# EAGLE design Sensor_MT9P (EAGLE 9.2.1)
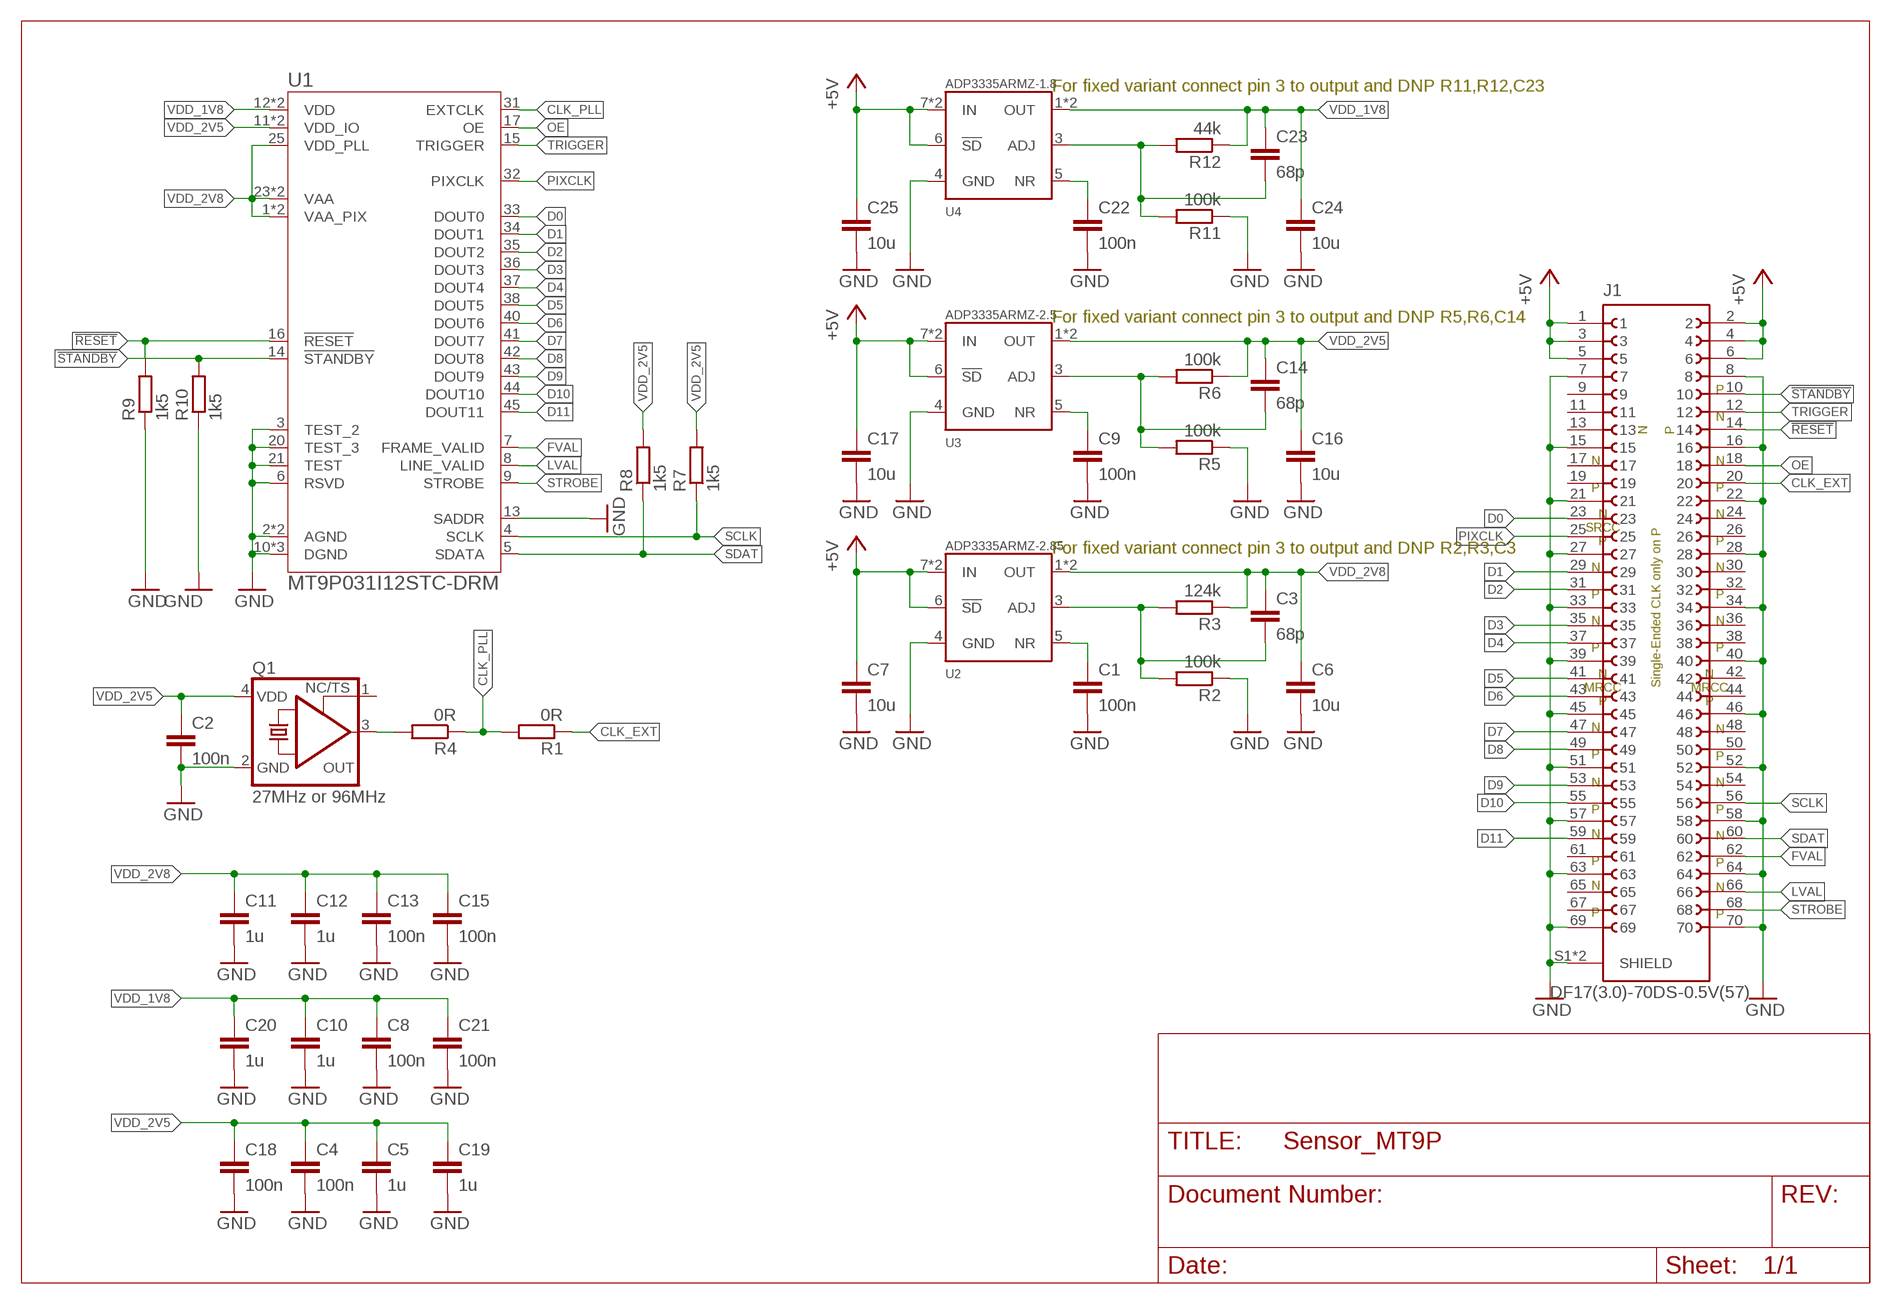
[diagram p0: schematic, sheet 1]

## Parts
C1  100n  C-EUC0402  [C0402]
C2  100n  C-EUC0402  [C0402]
C3  68p  C-EUC0402  [C0402]
C4  100n  C-EUC0402  [C0402]
C5  1u  C-EUC0402  [C0402]
C6  10u  C-EUC0603  [C0603]
C7  10u  C-EUC0603  [C0603]
C8  100n  C-EUC0402  [C0402]
C9  100n  C-EUC0402  [C0402]
C10  1u  C-EUC0402  [C0402]
C11  1u  C-EUC0402  [C0402]
C12  1u  C-EUC0402  [C0402]
C13  100n  C-EUC0402  [C0402]
C14  68p  C-EUC0402  [C0402]
C15  100n  C-EUC0402  [C0402]
C16  10u  C-EUC0603  [C0603]
C17  10u  C-EUC0603  [C0603]
C18  100n  C-EUC0402  [C0402]
C19  1u  C-EUC0402  [C0402]
C20  1u  C-EUC0402  [C0402]
C21  100n  C-EUC0402  [C0402]
C22  100n  C-EUC0402  [C0402]
C23  68p  C-EUC0402  [C0402]
C24  10u  C-EUC0603  [C0603]
C25  10u  C-EUC0603  [C0603]
J1  DF17(3.0)-70DS-0.5V(57)  [DF17(3.0)-70DS-0.5V(57)]
Q1  27MHz or 96MHz  KXO-PXO/XO-V96  [3.2X2.5_KXO-V96]
R1  0R  R-EU_R0402  [R0402]
R2  100k  R-EU_R0402  [R0402]
R3  124k  R-EU_R0402  [R0402]
R4  0R  R-EU_R0402  [R0402]
R5  100k  R-EU_R0402  [R0402]
R6  100k  R-EU_R0402  [R0402]
R7  1k5  R-EU_R0402  [R0402]
R8  1k5  R-EU_R0402  [R0402]
R9  1k5  R-EU_R0402  [R0402]
R10  1k5  R-EU_R0402  [R0402]
R11  100k  R-EU_R0402  [R0402]
R12  44k  R-EU_R0402  [R0402]
U1  MT9P031I12STC-DRM  [ILCC48_10X10_847AA-O_OSI-M]
U2  ADP3335ARMZ-2.85  NCP3335  [MSOP08]
U3  ADP3335ARMZ-2.5  NCP3335  [MSOP08]
U4  ADP3335ARMZ-1.8  NCP3335  [MSOP08]

## Nets
!RESET: J1.14 R9.2 U1.16(!RESET)
!STANDBY: J1.10 R10.2 U1.14(!STANDBY)
+5V: C7.1 C17.1 C25.1 J1.1 J1.2 J1.3 J1.4 J1.5 J1.6 U2.6(!SD) U2.7(IN) U2.8(IN) U3.6(!SD) U3.7(IN) U3.8(IN) U4.6(!SD) U4.7(IN) U4.8(IN)
CLK: Q1.3(OUT) R4.2
CLK_EXT: J1.20 R1.1
CLK_PLL: R1.2 R4.1 U1.31(EXTCLK)
D0: J1.23 U1.33(DOUT0)
D1: J1.29 U1.34(DOUT1)
D2: J1.31 U1.35(DOUT2)
D3: J1.35 U1.36(DOUT3)
D4: J1.37 U1.37(DOUT4)
D5: J1.41 U1.38(DOUT5)
D6: J1.43 U1.40(DOUT6)
D7: J1.47 U1.41(DOUT7)
D8: J1.49 U1.42(DOUT8)
D9: J1.53 U1.43(DOUT9)
D10: J1.55 U1.44(DOUT10)
D11: J1.59 U1.45(DOUT11)
FVAL: J1.62 U1.7(FRAME_VALID)
GND: C1.2 C2.2 C4.2 C5.2 C6.2 C7.2 C8.2 C9.2 C10.2 C11.2 C12.2 C13.2 C15.2 C16.2 C17.2 C18.2 C19.2 C20.2 C21.2 C22.2 C24.2 C25.2 J1.7 J1.8 J1.15 J1.16 J1.21 J1.22 J1.27 J1.28 J1.33 J1.34 J1.39 J1.40 J1.45 J1.46 J1.51 J1.52 J1.57 J1.58 J1.63 J1.64 J1.69 J1.70 J1.S1(SHIELD) J1.S2(SHIELD) Q1.2(GND) R2.1 R5.1 R9.1 R10.1 R11.1 U1.2(AGND) U1.3(TEST_2) U1.6(RSVD) U1.10(DGND) U1.13(SADDR) U1.20(TEST_3) U1.21(TEST) U1.22(AGND) U1.26(DGND) U1.46(DGND) U2.4(GND) U3.4(GND) U4.4(GND)
LVAL: J1.66 U1.8(LINE_VALID)
N$00002: C1.1 U2.5(NR)
N$00003: C22.1 U4.5(NR)
N$00004: C9.1 U3.5(NR)
N$00005: C23.2 R11.2 R12.2 U4.3(ADJ)
N$00006: C14.2 R5.2 R6.2 U3.3(ADJ)
N$00010: C3.2 R2.2 R3.2 U2.3(ADJ)
OE: J1.18 U1.17(OE)
PIXCLK: J1.25 U1.32(PIXCLK)
SCLK: J1.56 R7.1 U1.4(SCLK)
SDAT: J1.60 R8.1 U1.5(SDATA)
STROBE: J1.68 U1.9(STROBE)
TRIGGER: J1.12 U1.15(TRIGGER)
VDD_1V8: C8.1 C10.1 C20.1 C21.1 C23.1 C24.1 R12.1 U1.12(VDD) U1.47(VDD) U4.1(OUT) U4.2(OUT)
VDD_2V5: C2.1 C4.1 C5.1 C14.1 C16.1 C18.1 C19.1 Q1.4(VDD) R6.1 R7.2 R8.2 U1.11(VDD_IO) U1.39(VDD_IO) U3.1(OUT) U3.2(OUT)
VDD_2V8: C3.1 C6.1 C11.1 C12.1 C13.1 C15.1 R3.1 U1.1(VAA_PIX) U1.23(VAA) U1.24(VAA) U1.25(VDD_PLL) U1.48(VAA_PIX) U2.1(OUT) U2.2(OUT)
Unconnected: J1.9 J1.11 J1.13 J1.17 J1.19 J1.24 J1.26 J1.30 J1.32 J1.36 J1.38 J1.42 J1.44 J1.48 J1.50 J1.54 J1.61 J1.65 J1.67 Q1.1(TS)

## Notes on the sheet
- For fixed variant connect pin 3 to output and DNP R11,R12,C23
- For fixed variant connect pin 3 to output and DNP R5,R6,C14
- P
   
  N
- N
   
  P
- N
   
  P
- N
   
  P
- N
  SRCC
  P
- N
   
  P
- For fixed variant connect pin 3 to output and DNP R2,R3,C3
- N
   
  P
- N
   
  P
- Single-Ended CLK only on P
- N
   
  P
- N
   
  P
- N
  MRCC
  P
- N
  MRCC
  P
- N
   
  P
- N
   
  P
- N
   
  P
- N
   
  P
- N
   
  P
- N
   
  P
- N
   
  P
- N
   
  P

## Library data of the parts
C1 C3 C4 C8 C9 C13-C15 C18 C21-C23 = rcl:C-EU: CAPACITOR, European symbol; LCSC: C1525; SPICEPREFIX: C
C2 = rcl:C-EU: CAPACITOR, European symbol; LCSC: C1525
C5-C7 C10-C12 C16 C17 C19 C20 C24 C25 = rcl:C-EU: CAPACITOR, European symbol; SPICEPREFIX: C
J1 = Hirose:DF17(3.0)-70DS-0.5V(57)
Q1 = crystal-geyer_V1_0:KXO-PXO/XO-V: Clock Oscillator (PXO/XO) MHz : KXO-V - Serie Model Size l/w/h [mm] Frequency Range Frequency Stability Temp. Range [°C] Output AECQ 200 availabel Datasheet KXO-V94 KXO-V94 KXO-V95 KXO-V95 KXO-V96 KXO-V96 KXO-V99 KXO-V99 KXO-97 KXO-V97 KXO-97 - KXO-V97 2.0/1.6/0.80 2.0/1.6/0.80 2.5/2.0/0.82 2.5/2.0/0.82 3.2/2.5/1.2 3.2/2.5/1.2 5.0/3.2/1.2 5.0/3.2/1.2 7.0/5.08/1.3 7.0/5.08/1.3 7.0/5.08/1.3 32,768 kHz 1,0 ~ 80,0 MHz 32,768 kHz 1,0 ~ 70,0 MHz 32,768 kHz 1,0 ~ 156,0 MHz 32,768 kHz 1,0 ~ 200,0 MHz 32,768 kHz 32,768 kHz 1,0 ~ 160,0 MHz ±25 … ±100ppm ±25 … ±100ppm ±25 … ±100ppm ±25 … ±100ppm ±25 … ±100ppm ±25 … ±100ppm ±25 … ±100ppm ±25 … ±100ppm ±25 … ±100ppm ±25 … ±100ppm ±25 … ±100ppm (*) -40°C …+85°C (*) -40°C …+85°C (*) -40°C …+85°C (*) -40°C …+85°C (*) -40°C …+85°C (*) -40°C …+85°C (*) -40°C …+85°C (*) -40°C …+85°C (*) -40°C …+85°C (*) -40°C …+85°C (*) -40°C …+85°C HCMOS HCMOS HCMOS HCMOS HCMOS HCMOS HCMOS HCMOS HCMOS HCMOS HCMOS - - yes yes yes yes - - - - - KXO-V94-kHz.pdf <http://www.geyer-electronic.de/uploads/tx_userartikelfrequenz/GEYER-KXO-V94-kHz.pdf> KXO-V94.pdf <http://www.geyer-electronic.de/uploads/tx_userartikelfrequenz/GEYER-KXO-V94.pdf> KXO-V95-kHz.pdf <http://www.geyer-electronic.de/uploads/tx_userartikelfrequenz/GEYER-KXO-V95-kHz.pdf> KXO-V95.pdf <http://www.geyer-electronic.de/uploads/tx_userartikelfrequenz/GEYER-KXO-V95.pdf> KXO-V96-kHz.pdf <http://www.geyer-electronic.de/uploads/tx_userartikelfrequenz/GEYER-KXO-V96-kHz.pdf> KXO-V96.pdf <http://www.geyer-electronic.de/uploads/tx_userartikelfrequenz/GEYER-KXO-V96.pdf> KXO-V99-kHz.pdf <http://www.geyer-electronic.de/uploads/tx_userartikelfrequenz/GEYER-KXO-V99-kHz.pdf> KXO-V99.pdf <http://www.geyer-electronic.de/uploads/tx_userartikelfrequenz/GEYER-KXO-V99.pdf> KXO-97-kHz.pdf <http://www.geyer-electronic.de/uploads/tx_userartikelfrequenz/GEYER-KXO-97-kHz.pdf> KXO-V97-kHz.pdf <http://www.geyer-electronic.de/uploads/tx_userartikelfrequenz/GEYER-KXO-V97-kHz.pdf> KXO-V97.pdf <http://www.geyer-electronic.de/uploads/tx_userartikelfrequenz/GEYER-KXO-V97.pdf> <http://www.geyer-electronic.de/fileadmin/template/img/logo-geyer-electronic.png> Details see: http://www.geyer-electronic.de/Frequenz-Produkte.9.0.html Created 2016-06-07, Hans Locher 2016 (C) Geyer Quartz Technology Hans Locher KXOV94,KXOV95;KXOV96;KXOV97;KXO97;2016;2520;3225;5032;70508;2,5x2,0;3,2x2,5;5,0x3,2;7,0x5,08;2.5x2.0;3.2x2.5;5.0x3.2;7.0x5.08;
R1-R12 = rcl:R-EU_: RESISTOR, European symbol; SPICEPREFIX: R
U1 = onsemi:MT9P031I12STC-DR; DIGIKEY: MT9P031I12STC-DR-ND; MANUFACTURER_NAME: onsemi; MPN: MT9P031I12STC-DR
U2 = analog_devices:NCP3335: NCP3335 Low Dropout Regulator - Ultra High Accuracy, Low Iq, 500 mA; DIGIKEY: 505-ADP3335ARMZ-3.3RL7CT-ND
U3 = analog_devices:NCP3335: NCP3335 Low Dropout Regulator - Ultra High Accuracy, Low Iq, 500 mA; DIGIKEY: 505-ADP3335ARMZ-2.5-RLCT-ND
U4 = analog_devices:NCP3335: NCP3335 Low Dropout Regulator - Ultra High Accuracy, Low Iq, 500 mA; DIGIKEY: 505-ADP3335ARMZ-1.8-R7CT-ND

## Board
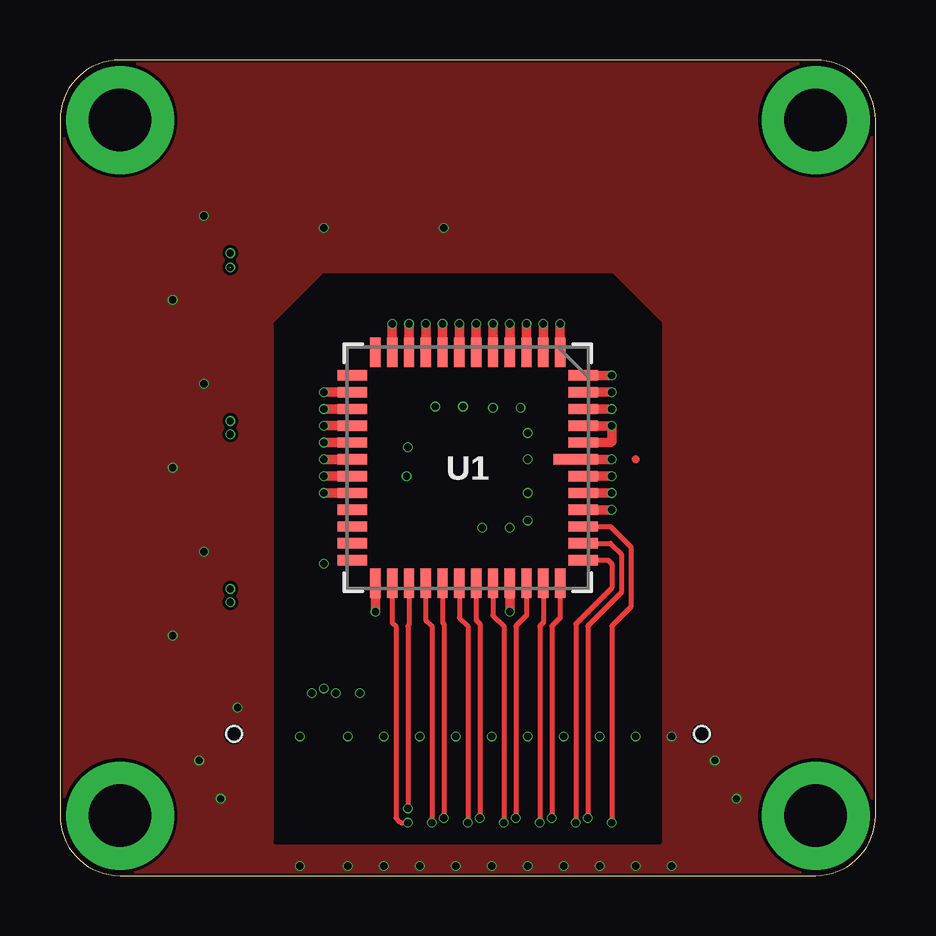
[diagram p1: board, top side]
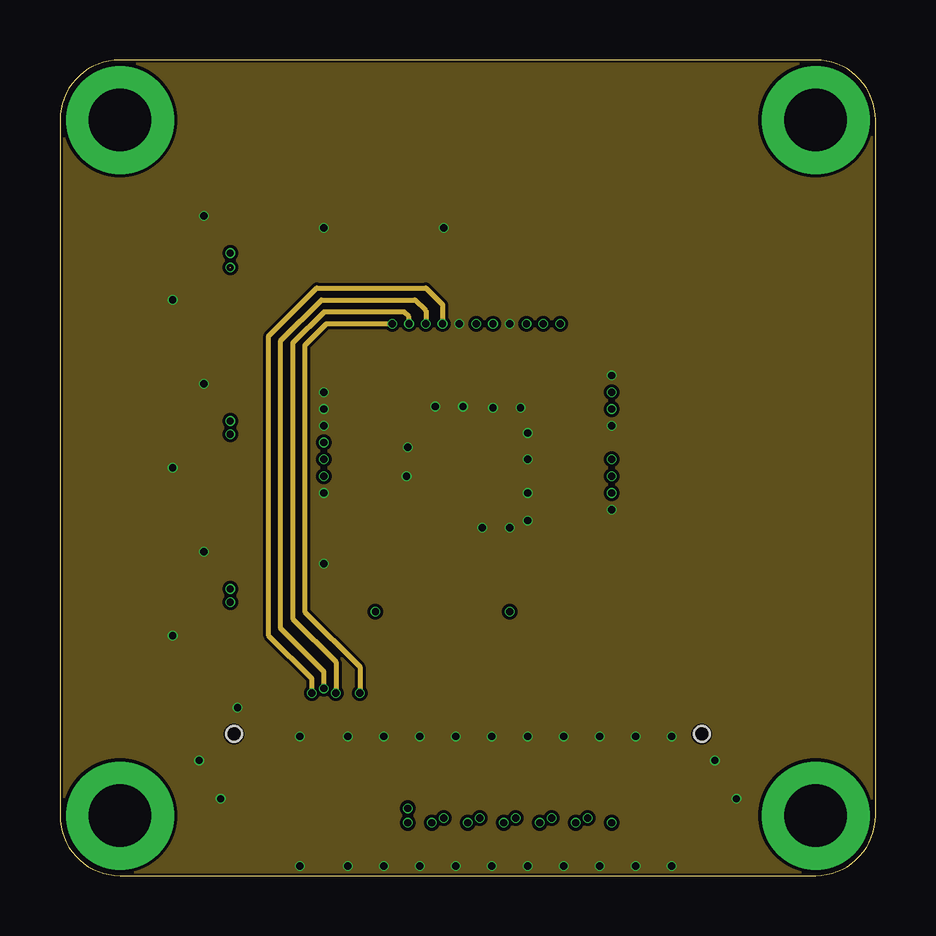
[diagram p2: board, inner layer Route2]
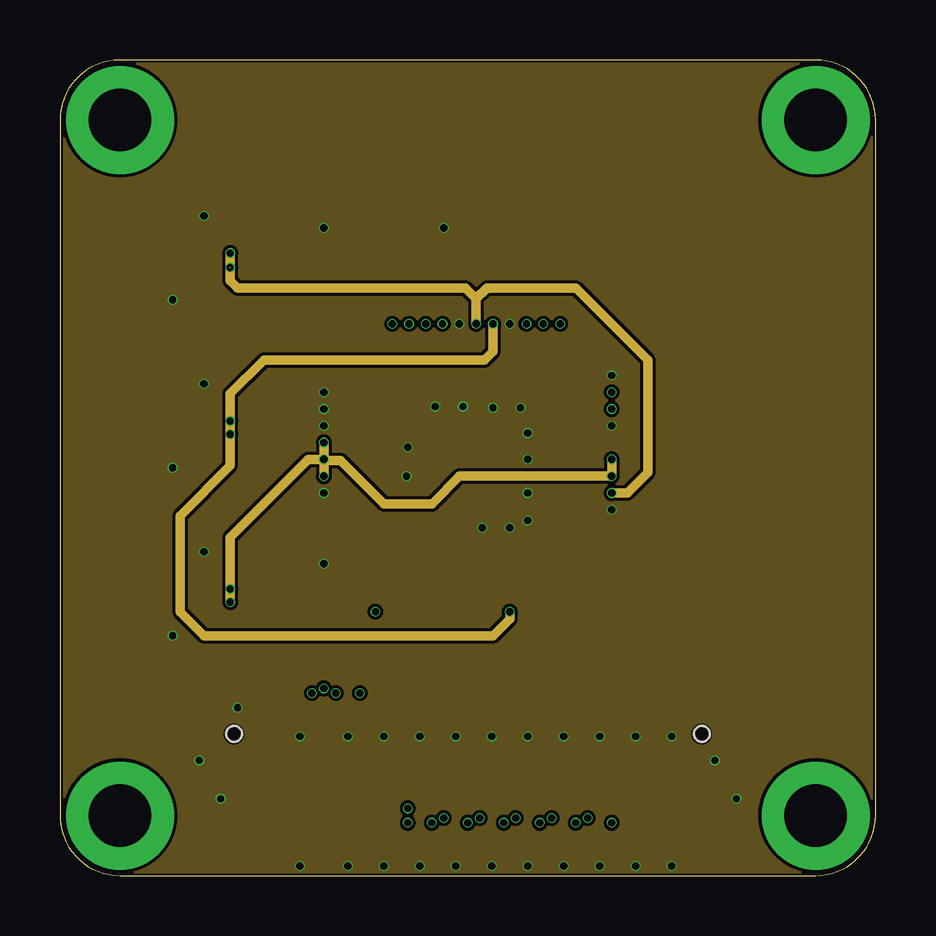
[diagram p3: board, inner layer Route15]
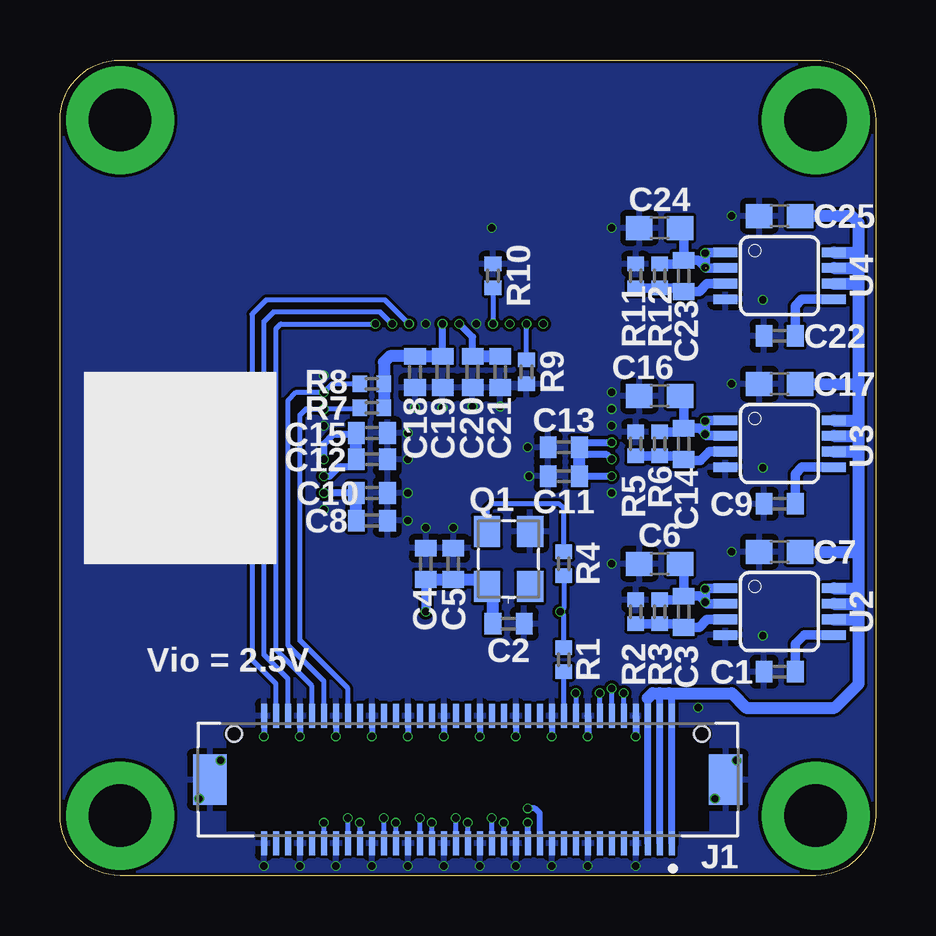
[diagram p4: board, bottom side, seen from below]

Size 34 x 34 mm. Coordinates in mm from the lower left corner, seen from the top.
Outline: 0,31.5 0,2.5 arc90 2.5,0 31.5,0 arc90 34,2.5 34,31.5 arc90 31.5,34 2.5,34 arc90 0,31.5
Copper layers (1*2*15*16): Top 0.035559375mm / dielectric 0.17018125mm / Route2 0.01778125mm / dielectric 47mil / Route15 0.01778125mm / dielectric 0.17018125mm / Bottom 0.035559375mm
Design rules "jlcpcb-4-layer *": minimum track width 5mil, minimum drill 0.2mm, track to track 5mil, track to pad 5mil, pad to pad 5mil, via to via 5mil, smd to smd 0mil, copper to edge 0.1mm, drill to drill 5mil, minimum pad ring 0.1mm, minimum via ring 0.05mm, stop-mask expansion 3mil, vias tented up to drill 100mil, thermal gap 10mil

### Footprints (pad centres in the part's own frame; a part is rotated, then mirrored left to right if it is on the bottom)
C0402 = smd 0.7 x 0.9: 1 -0.65,0; 2 0.65,0
C0603 = smd 1.1 x 1: 1 -0.85,0; 2 0.85,0
DF17(3.0)-70DS-0.5V(57) = smd 0.25 x 1: 1 -8.5,2.65; 2 -8.5,-2.65; 3 -8,2.65; 4 -8,-2.65; 5 -7.5,2.65; 6 -7.5,-2.65; 7 -7,2.65; 8 -7,-2.65; 9 -6.5,2.65; 10 -6.5,-2.65; 11 -6,2.65; 12 -6,-2.65; 13 -5.5,2.65; 14 -5.5,-2.65; 15 -5,2.65; 16 -5,-2.65; 17 -4.5,2.65; 18 -4.5,-2.65; 19 -4,2.65; 20 -4,-2.65; 21 -3.5,2.65; 22 -3.5,-2.65; 23 -3,2.65; 24 -3,-2.65; 25 -2.5,2.65; 26 -2.5,-2.65; 27 -2,2.65; 28 -2,-2.65; 29 -1.5,2.65; 30 -1.5,-2.65; 31 -1,2.65; 32 -1,-2.65; 33 -0.5,2.65; 34 -0.5,-2.65; 35 0,2.65; 36 0,-2.65; 37 0.5,2.65; 38 0.5,-2.65; 39 1,2.65; 40 1,-2.65; 41 1.5,2.65; 42 1.5,-2.65; 43 2,2.65; 44 2,-2.65; 45 2.5,2.65; 46 2.5,-2.65; 47 3,2.65; 48 3,-2.65; 49 3.5,2.65; 50 3.5,-2.65; 51 4,2.65; 52 4,-2.65; 53 4.5,2.65; 54 4.5,-2.65; 55 5,2.65; 56 5,-2.65; 57 5.5,2.65; 58 5.5,-2.65; 59 6,2.65; 60 6,-2.65; 61 6.5,2.65; 62 6.5,-2.65; 63 7,2.65; 64 7,-2.65; 65 7.5,2.65; 66 7.5,-2.65; 67 8,2.65; 68 8,-2.65; 69 8.5,2.65; 70 8.5,-2.65 | smd 1.4 x 2.1: S1 -10.75,0; S2 10.75,0 | hole 0.65: -9.75,-1.9; 9.75,-1.9
3.2X2.5_KXO-V96 = smd 1.3 x 1.1: 1 -1.15,-0.9; 2 1.15,-0.9; 3 1.15,0.9; 4 -1.15,0.9
R0402 = smd 0.6 x 0.7: 1 -0.5,0; 2 0.5,0
ILCC48_10X10_847AA-O_OSI-M = smd 0.432 x 1.85: 1 -0.35,4.504 | smd 0.432 x 1.238: 2 -1.05,4.81; 3 -1.75,4.81; 4 -2.45,4.81; 5 -3.15,4.81; 6 -3.85,4.81; 19 -3.85,-4.81; 20 -3.15,-4.81; 21 -2.45,-4.81; 22 -1.75,-4.81; 23 -1.05,-4.81; 24 -0.35,-4.81; 25 0.35,-4.81; 26 1.05,-4.81; 27 1.75,-4.81; 28 2.45,-4.81; 29 3.15,-4.81; 30 3.85,-4.81; 43 3.85,4.81; 44 3.15,4.81; 45 2.45,4.81; 46 1.75,4.81; 47 1.05,4.81; 48 0.35,4.81 | smd 1.238 x 0.432: 7 -4.81,3.85; 8 -4.81,3.15; 9 -4.81,2.45; 10 -4.81,1.75; 11 -4.81,1.05; 12 -4.81,0.35; 13 -4.81,-0.35; 14 -4.81,-1.05; 15 -4.81,-1.75; 16 -4.81,-2.45; 17 -4.81,-3.15; 18 -4.81,-3.85; 31 4.81,-3.85; 32 4.81,-3.15; 33 4.81,-2.45; 34 4.81,-1.75; 35 4.81,-1.05; 36 4.81,-0.35; 37 4.81,0.35; 38 4.81,1.05; 39 4.81,1.75; 40 4.81,2.45; 41 4.81,3.15; 42 4.81,3.85
MSOP08 = smd 0.4 x 1: 1 -0.976,-2.263; 2 -0.326,-2.263; 3 0.324,-2.263; 4 0.974,-2.263; 5 0.974,2.262; 6 0.324,2.262; 7 -0.326,2.262; 8 -0.976,2.262

### Placement (x,y rotation side)
C1  4,8.5 180 bottom
C2  15.3,10.5 0 bottom
C3  8,11 270 bottom
C4  18.75,13 90 bottom
C5  17.6,13 90 bottom
C6  9,13 180 bottom
C7  4,13.5 180 bottom
C8  21,14.8 0 bottom
C9  4,15.5 180 bottom
C10  21,15.95 0 bottom
C11  13,16.65 180 bottom
C12  21,17.35 0 bottom
C13  13,17.85 180 bottom
C14  8,18 270 bottom
C15  21,18.45 0 bottom
C16  9,20 180 bottom
C17  4,20.5 180 bottom
C18  19.2,21 270 bottom
C19  18.05,21 270 bottom
C20  16.8,21 270 bottom
C21  15.65,21 270 bottom
C22  4,22.5 180 bottom
C23  8,25 270 bottom
C24  9,27 180 bottom
C25  4,27.5 180 bottom
J1  17,4 180 bottom
Q1  15.3,13.2 90 bottom
R1  13,9 90 bottom
R2  10,11 270 bottom
R3  9,11 270 bottom
R4  13,13 90 bottom
R5  10,18 270 bottom
R6  9,18 270 bottom
R7  21,19.5 0 bottom
R8  21,20.5 0 bottom
R9  14.55,21 90 bottom
R10  15.95,25 270 bottom
R11  10,25 270 bottom
R12  9,25 270 bottom
U1  17,17 270 top
U2  4,11 270 bottom
U3  4,18 270 bottom
U4  4,25 270 bottom

### Tracks (layer width: path | path; a pad name or v marks a point on that pad's centre or on a via)
!RESET  (via drill 0.3)
  Top 0.4: U1.16 v14.55,23
  Route2 0.2: v14.55,23 14.55,23.3 14.35,23.5 11,23.5 9.7,22.2 9.7,10.7 11.5,8.9 v11.5,7.6
  Bottom 0.2: R9.2 v14.55,23 | J1.14 v11.5,7.6
!STANDBY  (via drill 0.3)
  Top 0.4: U1.14 v15.95,23
  Route2 0.2: v10.5,7.6 10.5,8.2 8.7,10 8.7,22.5 10.7,24.5 15.25,24.5 15.95,23.8 v15.95,23
  Bottom 0.2: J1.10 v10.5,7.6 | R10.2 v15.95,23
+5V
  Bottom 0.3: J1.1 J1.2 8.5,7.5 8.6,7.6 | J1.3 J1.4 9,7.6 | J1.5 J1.6 9.5,7.4
  Bottom 0.5: 9.5,7.4 9.3,7.6 9,7.6 8.6,7.6 6,7.6 5.4,7 1.7,7 0.7,8 0.7,10.6 | C25.1 1,27.5 0.7,27.2 0.7,25.9 | 0.7,10.6 0.7,11.4 | 0.7,11.4 0.7,12 | 0.7,12 0.7,13.5 | 0.7,13.5 0.7,17.7 | 0.7,17.7 0.7,18.3 | 0.7,18.3 0.7,19 | 0.7,19 0.7,20.4 | 0.7,20.4 0.7,24.7 | 0.7,24.7 0.7,25.4 | 0.7,25.4 0.7,25.9 | U2.8 0.72,11.98 0.7,12 | U2.7 0.77,11.33 0.7,11.4 | U2.6 0.78,10.68 0.7,10.6 | C7.1 0.7,13.5 | U3.6 0.72,17.68 0.7,17.7 | U3.7 0.73,18.33 0.7,18.3 | U3.8 0.72,18.98 0.7,19 | C17.1 0.8,20.5 0.7,20.4 | U4.6 0.72,24.68 0.7,24.7 | U4.7 0.77,25.33 0.7,25.4 | U4.8 0.78,25.98 0.7,25.9
CLK
  Bottom 0.2: R4.2 13,15.3 13.2,15.5 16,15.5 16.2,15.3 Q1.3
CLK_EXT
  Bottom 0.2: J1.20 R1.1
CLK_PLL  (via drill 0.3)
  Top 0.4: U1.31 v13.15,11
  Bottom 0.2: R1.2 13,10.85 v13.15,11 13,11.15 R4.1
D0  (via drill 0.3)
  Top 0.2: U1.33 14.55,10.45 14.5,10.4 v14.5,2.8
  Bottom 0.25: J1.23 14,2.6 14.2,2.8 v14.5,2.8
D1  (via drill 0.3)
  Top 0.2: U1.34 15.25,10.65 15.5,10.4 v15.5,2.2
  Bottom 0.2: J1.29 v15.5,2.2
D2  (via drill 0.3)
  Top 0.2: U1.35 15.95,10.55 16,10.5 v16,2.4
  Bottom 0.2: J1.31 v16,2.4
D3  (via drill 0.3)
  Top 0.2: U1.36 16.65,10.75 17,10.4 v17,2.2
  Bottom 0.2: J1.35 v17,2.2
D4  (via drill 0.3)
  Top 0.2: U1.37 17.35,10.65 17.5,10.5 v17.5,2.4
  Bottom 0.2: J1.37 v17.5,2.4
D5  (via drill 0.3)
  Top 0.2: U1.38 18.05,10.85 18.5,10.4 v18.5,2.2
  Bottom 0.2: J1.41 v18.5,2.2
D6  (via drill 0.3)
  Top 0.2: U1.40 19.45,10.85 19,10.4 v19,2.4
  Bottom 0.2: J1.43 v19,2.4
D7  (via drill 0.3)
  Top 0.2: U1.41 20.15,10.55 20,10.4 v20,2.2
  Bottom 0.2: J1.47 v20,2.2
D8  (via drill 0.3)
  Top 0.2: U1.42 20.85,10.75 20.5,10.4 v20.5,2.4
  Bottom 0.2: J1.49 v20.5,2.4
D9  (via drill 0.3)
  Top 0.2: U1.43 22.85,13.15 23,13 23,12 21.5,10.5 v21.5,2.2
  Bottom 0.2: J1.53 v21.5,2.2
D10  (via drill 0.3)
  Top 0.2: U1.44 22.95,13.85 23.4,13.4 23.4,11.8 22,10.4 v22,2.4
  Bottom 0.2: J1.55 v22,2.4
D11  (via drill 0.3)
  Top 0.2: U1.45 22.95,14.55 23.8,13.7 23.8,11.2 23,10.4 v23,2.2
  Bottom 0.2: J1.59 v23,2.2
FVAL  (via drill 0.3)
  Top 0.4: U1.7 v20.85,23
  Bottom 0.2: v20.85,23 24.8,23 25,22.8 25,9.4 23.5,7.9 J1.62
GND  (via drill 0.3)
  Top 0.4: U1.13 v16.65,23 | U1.10 v18.75,23 | v18.75,23 | U1.6 v23,20.85 | U1.3 v23,18.75 23,18.1 22.95,18.05 U1.2 | U1.46 v23,15.25 | v23,15.25 | U1.26 v11,15.95 | U1.22 v11,18.75 | v11,18.75 | U1.21 v11,19.45 | U1.20 v11,20.15
  Bottom 0.25: J1.40 v18,5.8 | J1.46 v19.5,5.8 | J1.52 v21,5.8 | J1.58 v22.5,5.8 | J1.34 v16.5,5.8 | J1.64 v24,5.8 | J1.28 v15,5.8 | J1.22 v13.5,5.8 | J1.70 v25.5,5.8
  Bottom 0.3: J1.16 v12,5.8 | J1.8 v10,5.8
  other vias: 15,0.4 16.5,0.4 18,0.4 19.5,0.4 21,0.4 22.5,0.4 24,0.4 5.8,4.8 6.7,3.2 27.3,4.8 28.2,3.2 13.5,0.4 12,0.4 10,0.4 25.5,0.4 4.7,17 4.7,24 4.7,10 7.4,7 19.5,15.95 19.5,14.8 19.5,17.35 19.5,18.45 19.2,19.5 18.05,19.5 16.8,19.55 15.65,19.55 14.5,17.85 14.45,16.65 17.6,14.5 18.75,14.5 6,13.5 6,20.5 6,27.5 11,27 16,27 11,13
  pour Top: 0,0 34,0 34,34 0,34
  pour Bottom: 0,0 34,0 34,34 0,34
  pour Route15 (rank 2): 0,0 34,0 34,34 0,34
  pour Route2: 0,0 34,0 34,34 0,34
  cutout Top: 25,1.4 25,23 23,25 11,25 9,23 9,1.4
LVAL  (via drill 0.3)
  Top 0.4: U1.8 v20.15,23
  Bottom 0.2: v20.15,23 20.65,23.5 25.1,23.5 25.5,23.1 25.5,9.2 24.5,8.2 J1.66
N$00001  (via drill 2.6 pad 4.5)
  other vias: 31.5,31.5
N$00002
  Bottom 0.4: U2.5 2.97,10.03 3.35,9.65 C1.1
N$00003
  Bottom 0.4: U4.5 3.07,24.03 3.35,23.75 C22.1
N$00004
  Bottom 0.4: U3.5 3.07,17.03 3.35,16.75 C9.1
N$00005
  Bottom 0.4: R11.2 R12.2 8.15,24.5 C23.2 7.35,24.35 7.02,24.68 U4.3
N$00006
  Bottom 0.4: U3.3 6.92,17.68 7.3,17.3 7.95,17.3 C14.2 8.15,17.5 R6.2 R5.2
N$00010
  Bottom 0.4: U2.3 7.02,10.68 7.35,10.35 C3.2 8.15,10.5 R3.2 R2.2
N$00025  (via drill 2.6 pad 4.5)
  other vias: 2.5,31.5
N$00027  (via drill 2.6 pad 4.5)
  other vias: 2.5,2.5
N$00028  (via drill 2.6 pad 4.5)
  other vias: 31.5,2.5
OE  (via drill 0.3)
  Top 0.4: U1.17 v13.85,23
  Route2 0.2: v13.85,23 11.1,23 10.2,22.1 10.2,11 12.5,8.7 v12.5,7.6
  Bottom 0.2: v12.5,7.6 J1.18
PIXCLK  (via drill 0.3)
  Top 0.2: U1.32 13.85,10.55 14,10.4 14,2.4 14.2,2.2 v14.5,2.2
  Bottom 0.25: J1.25 v14.5,2.2
SCLK  (via drill 0.3)
  Top 0.4: U1.4 v23,19.45
  Bottom 0.2: J1.56 22,7.8 24,9.8 24,19.2 23.75,19.45 v23,19.45 21.55,19.45
  Bottom 0.3: R7.1 21.55,19.45
SDAT  (via drill 0.3)
  Top 0.4: U1.5 v23,20.15
  Bottom 0.2: J1.60 23,8.1 24.5,9.6 24.5,19.8 24.15,20.15 v23,20.15 22.65,20.5 R8.1
STROBE  (via drill 0.3)
  Top 0.4: U1.9 v19.45,23
  Bottom 0.2: v19.45,23 20.45,24 25.4,24 26,23.4 26,9 25,8 J1.68
TRIGGER  (via drill 0.3)
  Top 0.4: U1.15 v15.25,23
  Route2 0.2: v11,7.8 11,8.5 9.2,10.3 9.2,22.3 10.9,24 14.8,24 15.25,23.55 v15.25,23
  Bottom 0.2: J1.12 v11,7.8
VDD_1V8  (via drill 0.3)  (1 unrouted)
  Top 0.4: U1.12 v17.35,23 | U1.47 v23,15.95
  Route15 0.4: v7.1,25.95 v7.1,25.35 7.1,24.8 7.4,24.5 16.9,24.5 17.35,24.05 | 17.35,24.05 v17.35,23 | 17.35,24.05 17.8,24.5 21.5,24.5 24.5,21.5 24.5,16.8 23.65,15.95 v23,15.95
  Bottom 0.3: C20.1 16.8,22.45 v17.35,23 | C10.1 v23,15.95
  Bottom 0.4: U4.1 7.1,25.98 v7.1,25.95 v7.1,25.35 7.4,25.65 C23.1 | U4.2 7.07,25.33 | R12.1 8.15,25.5 C23.1 | C23.1 8,26.85 C24.1
  Bottom 0.5: C20.1 C21.1 | C8.1 C10.1
VDD_2V5  (via drill 0.3)
  Top 0.4: U1.11 v18.05,23 | U1.39 v18.75,11
  Route15 0.4: v18.05,23 18.05,21.85 17.7,21.5 8.5,21.5 7.1,20.1 v7.1,18.95 v7.1,18.4 7.1,17.1 5,15 5,11 6,10 18.05,10 18.75,10.7 v18.75,11
  Bottom 0.3: C19.1 v18.05,23
  Bottom 0.4: U3.1 7.1,18.98 v7.1,18.95 v7.1,18.4 | v7.1,18.4 7.05,18.35 6.29,18.35 U3.2 | v18.75,11 C4.1 | R6.1 8.15,18.5 C14.1 | v7.1,18.4 7.35,18.65 C14.1 | C14.1 8,19.85 C16.1
  Bottom 0.5: C4.1 C5.1 16.5,12.35 Q1.4 15.95,11.8 C2.1 | C19.1 C18.1 20.25,21.65 20.5,21.4 R8.2 R7.2
VDD_2V8  (via drill 0.3)
  Top 0.4: U1.48 v23,16.65 | v23,17.35 U1.1 | U1.25 v11,16.65 | v11,18.05 U1.23 | U1.24 v11,17.35
  Route15 0.4: v7.1,11.4 v7.1,11.95 7.1,14.1 10.35,17.35 v11,17.35 | v11,16.65 11,17.3 | 11,17.3 v11,17.35 | v11,17.35 v11,18.05 | v23,17.35 v23,16.65 16.65,16.65 15.5,15.5 13.5,15.5 11.7,17.3 11,17.3
  Bottom 0.3: v23,16.65 22.75,16.65 22.35,17.05 21.95,17.05 C12.1 | v23,17.35 23,18 22.6,18.4 21.65,18.4 | v11,18.05 12.15,18.05 C13.1 12.05,17.55 11.2,17.55 v11,17.35 | C11.1 v11,16.65
  Bottom 0.4: U2.1 7.1,11.98 v7.1,11.95 v7.1,11.4 | U2.2 7.03,11.33 v7.1,11.4 | C3.1 8.15,11.5 R3.1 | v7.1,11.4 7.35,11.65 C3.1 | C3.1 8,12.85 C6.1
  Bottom 0.5: C12.1 21.65,18.4 C15.1 | C11.1 C13.1
(copper drawn outside any net)
  shapes: Top circle x1

### Text on the board
bNames: Vio = 2.5V
tStop: MT9P031